# EAGLE design heptaphasis (EAGLE 9.3.2)
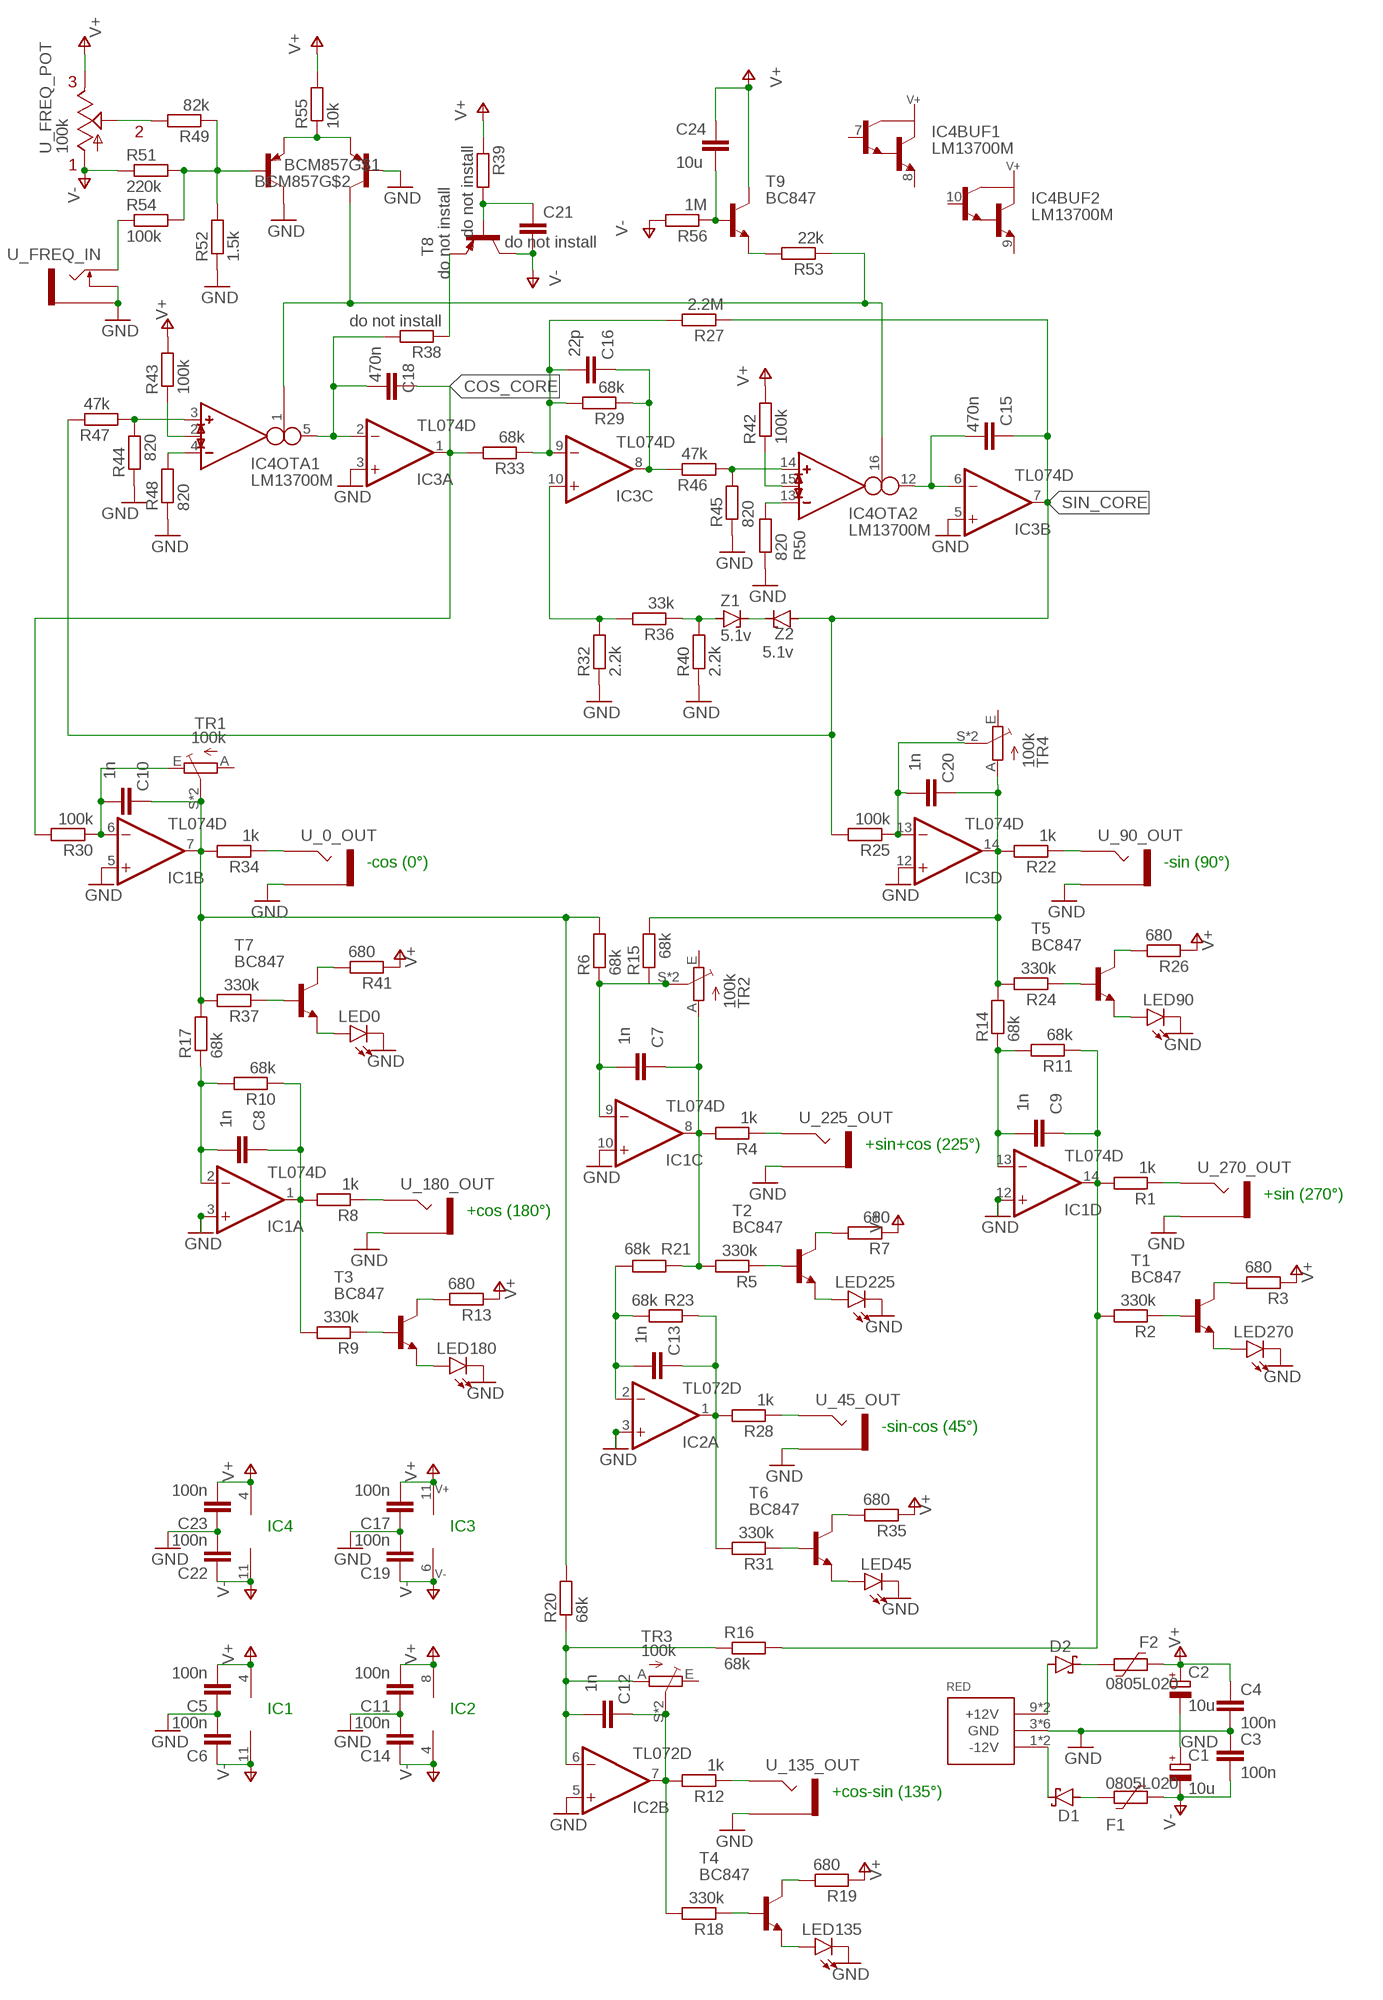
[diagram p0: schematic, sheet 1]

## Parts
BCM857  BCM857DS  [SOT457R_PHILIPS]
C1  10u  CPOL-EUE2-5  [E2-5]
C2  10u  CPOL-EUE2-5  [E2-5]
C3  100n  C-EUC0805  [C0805]
C4  100n  C-EUC0805  [C0805]
C5  100n  C-EUC0805  [C0805]
C6  100n  C-EUC0805  [C0805]
C7  1n  C-EUC0805  [C0805]
C8  1n  C-EUC0805  [C0805]
C9  1n  C-EUC0805  [C0805]
C10  1n  C-EUC0805  [C0805]
C11  100n  C-EUC0805  [C0805]
C12  1n  C-EUC0805  [C0805]
C13  1n  C-EUC0805  [C0805]
C14  100n  C-EUC0805  [C0805]
C15  470n  C-EUC0805  [C0805]
C16  22p  C-EUC0805  [C0805]
C17  100n  C-EUC0805  [C0805]
C18  470n  C-EUC0805  [C0805]
C19  100n  C-EUC0805  [C0805]
C20  1n  C-EUC0805  [C0805]
C21  do not install  C-EUC0805  [C0805]
C22  100n  C-EUC0805  [C0805]
C23  100n  C-EUC0805  [C0805]
C24  10u  C-EUC0805  [C0805]
D1  VERTICAL_SCHOTTKY  [DO41-7]
D2  VERTICAL_SCHOTTKY  [DO41-7]
F1  0805L020  [0805L]
F2  0805L020  [0805L]
IC1  TL074D  [SO14]
IC2  TL072D  [SO08]
IC3  TL074D  [SO14]
IC4  LM13700M  [SO16]
LED0  LED3MM  [LED3MM]
LED45  LED3MM  [LED3MM]
LED90  LED3MM  [LED3MM]
LED135  LED3MM  [LED3MM]
LED180  LED3MM  [LED3MM]
LED225  LED3MM  [LED3MM]
LED270  LED3MM  [LED3MM]
R1  1k  R-EU_R0805  [R0805]
R2  330k  R-EU_R0805  [R0805]
R3  680  R-EU_R0805  [R0805]
R4  1k  R-EU_R0805  [R0805]
R5  330k  R-EU_R0805  [R0805]
R6  68k  R-EU_R0805  [R0805]
R7  680  R-EU_R0805  [R0805]
R8  1k  R-EU_R0805  [R0805]
R9  330k  R-EU_R0805  [R0805]
R10  68k  R-EU_R0805  [R0805]
R11  68k  R-EU_R0805  [R0805]
R12  1k  R-EU_R0805  [R0805]
R13  680  R-EU_R0805  [R0805]
R14  68k  R-EU_R0805  [R0805]
R15  68k  R-EU_R0805  [R0805]
R16  68k  R-EU_R0805  [R0805]
R17  68k  R-EU_R0805  [R0805]
R18  330k  R-EU_R0805  [R0805]
R19  680  R-EU_R0805  [R0805]
R20  68k  R-EU_R0805  [R0805]
R21  68k  R-EU_R0805  [R0805]
R22  1k  R-EU_R0805  [R0805]
R23  68k  R-EU_R0805  [R0805]
R24  330k  R-EU_R0805  [R0805]
R25  100k  R-EU_R0805  [R0805]
R26  680  R-EU_R0805  [R0805]
R27  2.2M  R-EU_R0805  [R0805]
R28  1k  R-EU_R0805  [R0805]
R29  68k  R-EU_R0805  [R0805]
R30  100k  R-EU_R0805  [R0805]
R31  330k  R-EU_R0805  [R0805]
R32  2.2k  R-EU_R0805  [R0805]
R33  68k  R-EU_R0805  [R0805]
R34  1k  R-EU_R0805  [R0805]
R35  680  R-EU_R0805  [R0805]
R36  33k  R-EU_R0805  [R0805]
R37  330k  R-EU_R0805  [R0805]
R38  do not install  R-EU_R0805  [R0805]
R39  do not install  R-EU_R0805  [R0805]
R40  2.2k  R-EU_R0805  [R0805]
R41  680  R-EU_R0805  [R0805]
R42  100k  R-EU_R0805  [R0805]
R43  100k  R-EU_R0805  [R0805]
R44  820  R-EU_R0805  [R0805]
R45  820  R-EU_R0805  [R0805]
R46  47k  R-EU_R0805  [R0805]
R47  47k  R-EU_R0805  [R0805]
R48  820  R-EU_R0805  [R0805]
R49  82k  R-EU_R0805  [R0805]
R50  820  R-EU_R0805  [R0805]
R51  220k  R-EU_R0805  [R0805]
R52  1.5k  R-EU_R0805  [R0805]
R53  22k  R-EU_R0805  [R0805]
R54  100k  R-EU_R0805  [R0805]
R55  10k  R-EU_R0805  [R0805]
R56  1M  R-EU_R0805  [R0805]
RED  POWER_SIMPLE10  [POWER_10]
T1  BC847  [SOT23]
T2  BC847  [SOT23]
T3  BC847  [SOT23]
T4  BC847  [SOT23]
T5  BC847  [SOT23]
T6  BC847  [SOT23]
T7  BC847  [SOT23]
T8  do not install  BC857  [SOT23]
T9  BC847  [SOT23]
TR1  100k  MULTITURN_TRIMPOT_DUAL_FOOTPRINTS64YW  [S64YW]
TR2  100k  MULTITURN_TRIMPOT_DUAL_FOOTPRINTS64YW  [S64YW]
TR3  100k  MULTITURN_TRIMPOT_DUAL_FOOTPRINTS64YW  [S64YW]
TR4  100k  MULTITURN_TRIMPOT_DUAL_FOOTPRINTS64YW  [S64YW]
U_0_OUT  PJ302M_NO_NORM  [PJ302M_NO_NORM]
U_45_OUT  PJ302M_NO_NORM  [PJ302M_NO_NORM]
U_90_OUT  PJ302M_NO_NORM  [PJ302M_NO_NORM]
U_135_OUT  PJ302M_NO_NORM  [PJ302M_NO_NORM]
U_180_OUT  PJ302M_NO_NORM  [PJ302M_NO_NORM]
U_225_OUT  PJ302M_NO_NORM  [PJ302M_NO_NORM]
U_270_OUT  PJ302M_NO_NORM  [PJ302M_NO_NORM]
U_FREQ_IN  PJ302M  [PJ302M]
U_FREQ_POT  100k  RK097-SINGLE  [RK097-SINGLE-ELEMENT]
Z1  5.1v  ZENER-DIODESOD80C  [SOD80C]
Z2  5.1v  ZENER-DIODESOD80C  [SOD80C]

## Nets
0OUT: R34.1 U_0_OUT.TIP
45OUT: R28.1 U_45_OUT.TIP
90OUT: R22.1 U_90_OUT.TIP
135OUT: R12.1 U_135_OUT.TIP
180OUT: R8.1 U_180_OUT.TIP
225OUT: R4.1 U_225_OUT.TIP
270OUT: R1.1 U_270_OUT.TIP
+12DIODE_FUSE: D2.C F2.2
+12SUPPLY: D2.A RED.9(+12V) RED.10(+12V)
-12DIODE_FUSE: D1.A F1.2
-12SUPPLY: D1.C RED.1(-12V) RED.2(-12V)
BUF0_IN: C10.2 IC1.6(B:-IN) R30.1 TR1.E
BUF0OUT: C10.1 IC1.7(B:OUT) R6.2 R17.2 R20.2 R34.2 R37.2 TR1.S TR1.S@1(S)
BUF45_IN: C13.2 IC2.2(A:-IN) R21.1 R23.2
BUF45OUT: C13.1 IC2.1(A:OUT) R23.1 R28.2 R31.2
BUF90_IN: C20.2 IC3.13(D:-IN) R25.1 TR4.S TR4.S@1(S)
BUF90OUT: C20.1 IC3.14(D:OUT) R14.2 R15.2 R22.2 R24.2 TR4.A
BUF135_IN: C12.2 IC2.6(B:-IN) R16.1 R20.1 TR3.A
BUF135OUT: C12.1 IC2.7(B:OUT) R12.2 R18.2 TR3.S TR3.S@1(S)
BUF180_IN: C8.2 IC1.2(A:-IN) R10.2 R17.1
BUF180OUT: C8.1 IC1.1(A:OUT) R8.2 R9.2 R10.1
BUF225_IN: C7.2 IC1.9(C:-IN) R6.1 R15.1 TR2.S TR2.S@1(S)
BUF225OUT: C7.1 IC1.8(C:OUT) R4.2 R5.2 R21.2 TR2.A
BUF270_IN: C9.2 IC1.13(D:-IN) R11.2 R14.1
BUF270OUT: C9.1 IC1.14(D:OUT) R1.2 R2.2 R11.1 R16.2
COS_CORE: C18.1 IC3.1(A:OUT) R30.2 R33.2
COS_INTEG_IN: C18.2 IC3.2(A:-IN) IC4.5(OTA1:OUT) R38.2
COS_OTA1_IN+: IC4.3(OTA1:IN_P) R44.2 R47.1
COS_OTA1_NEGATIVE: IC4.4(OTA1:IN_N) R48.2
EXP_EMITTERS: BCM857.1(E) BCM857.4(E) R55.1
FREQ_CURRENT: BCM857.3(C) IC4.1(OTA1:I_BIAS) IC4.16(OTA2:I_BIAS) R53.1
FREQ_CV_IN: R54.1 U_FREQ_IN.TIP
FREQ_EXP_IN: BCM857.2(B) R49.1 R51.2 R52.2 R54.2
FREQ_POT: R49.2 U_FREQ_POT.P$5(S)
GND: BCM857.5(B) BCM857.6(C) C1.+ C2.- C3.1 C4.2 C5.1 C6.2 C11.1 C14.2 C17.1 C19.2 C22.2 C23.1 IC1.3(A:+IN) IC1.5(B:+IN) IC1.10(C:+IN) IC1.12(D:+IN) IC2.3(A:+IN) IC2.5(B:+IN) IC3.3(A:+IN) IC3.5(B:+IN) IC3.12(D:+IN) LED0.K(C) LED45.K(C) LED90.K(C) LED135.K(C) LED180.K(C) LED225.K(C) LED270.K(C) R32.1 R40.1 R44.1 R45.1 R48.1 R50.1 R52.1 RED.3(GND) RED.4(GND) RED.5(GND) RED.6(GND) RED.7(GND) RED.8(GND) U_0_OUT.GND(SLEEVE) U_45_OUT.GND(SLEEVE) U_90_OUT.GND(SLEEVE) U_135_OUT.GND(SLEEVE) U_180_OUT.GND(SLEEVE) U_225_OUT.GND(SLEEVE) U_270_OUT.GND(SLEEVE) U_FREQ_IN.GND(SLEEVE) U_FREQ_IN.SW(SWITCH)
HP_SUM: C16.1 IC3.8(C:OUT) R29.1 R46.2
LED0+: LED0.A T7.2(E)
LED0PWR: R41.2 T7.3(C)
LED0SIG: R37.1 T7.1(B)
LED45+: LED45.A T6.2(E)
LED45PWR: R35.2 T6.3(C)
LED45SIG: R31.1 T6.1(B)
LED90+: LED90.A T5.2(E)
LED90PWR: R26.2 T5.3(C)
LED90SIG: R24.1 T5.1(B)
LED135+: LED135.A T4.2(E)
LED135PWR: R19.2 T4.3(C)
LED135SIG: R18.1 T4.1(B)
LED180+: LED180.A T3.2(E)
LED180PWR: R13.2 T3.3(C)
LED180SIG: R9.1 T3.1(B)
LED225+: LED225.A T2.2(E)
LED225PWR: R7.2 T2.3(C)
LED225SIG: R5.1 T2.1(B)
LED270+: LED270.A T1.2(E)
LED270PWR: R3.2 T1.3(C)
LED270SIG: R2.1 T1.1(B)
LINEARIZING1: IC4.2(OTA1:I_DIODE) R43.1
LINEARIZING2: IC4.15(OTA2:I_DIODE) R42.1
NEG_FDBK: C16.2 IC3.9(C:-IN) R27.2 R29.2 R33.1
SIN_CORE: C15.1 IC3.7(B:OUT) R25.2 R27.1 R47.2 Z2.A
SIN_FEEDBACK: IC3.10(C:+IN) R32.2 R36.2
SIN_INTEG_IN: C15.2 IC3.6(B:-IN) IC4.12(OTA2:OUT)
SIN_OTA2_IN+: IC4.14(OTA2:IN_P) R45.2 R46.1
SIN_OTA2_NEGATIVE: IC4.13(OTA2:IN_N) R50.2
START_AMP_EMIT: R38.1 T8.2(E)
START_AMP_GATE: C21.1 R39.2 T8.1(B)
START_FREQ_EMIT: R53.2 T9.2(E)
START_FREQ_GATE: C24.2 R56.1 T9.1(B)
V+: C2.+ C4.1 C5.2 C11.2 C17.2 C23.2 C24.1 F2.1 IC1.4(P:V+) IC2.8(P:V+) IC3.4(P:V+) IC4.11(SUPPLY:V+) R3.1 R7.1 R13.1 R19.1 R26.1 R35.1 R39.1 R41.1 R42.2 R43.2 R55.2 T9.3(C) U_FREQ_POT.P$4(E)
V-: C1.- C3.2 C6.1 C14.1 C19.1 C21.2 C22.1 F1.1 IC1.11(P:V-) IC2.4(P:V-) IC3.11(P:V-) IC4.6(SUPPLY:V-) R51.1 R56.2 T8.3(C) U_FREQ_POT.P$6(A)
ZENER_ANODE: R36.1 R40.2 Z1.A
ZENERS_CATHODES: Z1.C Z2.C
Unconnected: IC4.7(BUF1:B) IC4.8(BUF1:E) IC4.9(BUF2:E) IC4.10(BUF2:B) TR1.A TR2.E TR3.E TR4.E

## Notes on the sheet
- -cos (0°) | -sin (90°)
- +sin+cos (225°)
- +sin (270°)
- +cos (180°)
- -sin-cos (45°)
- IC4 | IC3
- IC1 | IC2
- +cos-sin (135°)

## Library data of the parts
BCM857 = svf_quad_lfo:BCM857DS
C1 C2 = rcl:CPOL-EU: POLARIZED CAPACITOR, European symbol; SPICEPREFIX: C
C3-C24 = rcl:C-EU: CAPACITOR, European symbol; SPICEPREFIX: C
D1 D2 = vertical_schottky:VERTICAL_SCHOTTKY
F1 F2 = polyfuse-smd_10:?: Polyfuse Resettable PTC Source: http://www.littelfuse.com/products/resettable-ptcs.aspx; MF: Littelfuse; MPN: 0805L020; OC_FARNELL: 1832107; OC_NEWARK: 05M2226
IC1 IC3 = linear:TL074: OP AMP
IC2 = linear:TL072: OP AMP
IC4 = ota:LM13700: Dual OTA with buffers
LED0 LED45 LED90 LED135 LED180 LED225 LED270 = led:LED: LED OSRAM: - CHIPLED LG R971, LG N971, LY N971, LG Q971, LY Q971, LO R971, LY R971 LH N974, LH R974 LS Q976, LO Q976, LY Q976 LO Q996 - Hyper CHIPLED LW Q18S LB Q993, LB Q99A, LB R99A - SideLED LS A670, LO A670, LY A670, LG A670, LP A670 LB A673, LV A673, LT A673, LW A673 LH A674 LY A675 LS A676, LA A676, LO A676, LY A676, LW A676 LS A679, LY A679, LG A679 - Hyper Micro SIDELED® LS Y876, LA Y876, LO Y876, LY Y876 LT Y87S - SmartLED LW L88C, LW L88S LB L89C, LB L89S, LG L890 LS L89K, LO L89K, LY L89K LS L896, LA L896, LO L896, LY L896 - TOPLED LS T670, LO T670, LY T670, LG T670, LP T670 LSG T670, LSP T670, LSY T670, LOP T670, LYG T670 LG T671, LOG T671, LSG T671 LB T673, LV T673, LT T673, LW T673 LH T674 LS T676, LA T676, LO T676, LY T676, LB T676, LH T676, LSB T676, LW T676 LB T67C, LV T67C, LT T67C, LS T67K, LO T67K, LY T67K, LW E67C LS E67B, LA E67B, LO E67B, LY E67B, LB E67C, LV E67C, LT E67C LW T67C LS T679, LY T679, LG T679 LS T770, LO T770, LY T770, LG T770, LP T770 LB T773, LV T773, LT T773, LW T773 LH T774 LS E675, LA E675, LY E675, LS T675 LS T776, LA T776, LO T776, LY T776, LB T776 LHGB T686 LT T68C, LB T68C - Hyper Mini TOPLED® LB M676 - Mini TOPLED Santana® LG M470 LS M47K, LO M47K, LY M47K Source: http://www.osram.convergy.de LUXEON: - LUMILED® LXK2-PW12-R00, LXK2-PW12-S00, LXK2-PW14-U00, LXK2-PW14-V00 LXK2-PM12-R00, LXK2-PM12-S00, LXK2-PM14-U00 LXK2-PE12-Q00, LXK2-PE12-R00, LXK2-PE12-S00, LXK2-PE14-T00, LXK2-PE14-U00 LXK2-PB12-K00, LXK2-PB12-L00, LXK2-PB12-M00, LXK2-PB14-N00, LXK2-PB14-P00, LXK2-PB14-Q00 LXK2-PR12-L00, LXK2-PR12-M00, LXK2-PR14-Q00, LXK2-PR14-R00 LXK2-PD12-Q00, LXK2-PD12-R00, LXK2-PD12-S00 LXK2-PH12-R00, LXK2-PH12-S00 LXK2-PL12-P00, LXK2-PL12-Q00, LXK2-PL12-R00 Source: www.luxeon.com KINGBRIGHT: KA-3528ASYC Source: www.kingbright.com
R1-R56 = rcl:R-EU_: RESISTOR, European symbol; SPICEPREFIX: R
RED = eurorack:POWER_SIMPLE; SPICEPREFIX: U
T1-T7 T9 = nxp_60_sot457:BC847: 45 V, 100 mA NPN general-purpose transistors NPN general-purpose transistor AAL Eindhoven MK
T8 = nxp_60_sot457:BC857: PNP general purpose transistors AAL Eindhoven MK
TR1-TR4 = trimpot:MULTITURN_TRIMPOT_DUAL_FOOTPRINT: POTENTIOMETER
U_0_OUT U_45_OUT U_90_OUT U_135_OUT U_180_OUT U_225_OUT U_270_OUT = pj302m:PJ302M_NO_NORM: PJ302M horizontal / right angled mount 3.5 mm jack socket
U_FREQ_IN = pj302m:PJ302M: PJ302M horizontal / right angled mount 3.5 mm jack socket
U_FREQ_POT = alps_japan_potentiometers:RK097-SINGLE: SCHEMATIC FOR POTENTIOMETER
Z1 Z2 = diode:ZENER-DIODE: Z-Diode

## Board
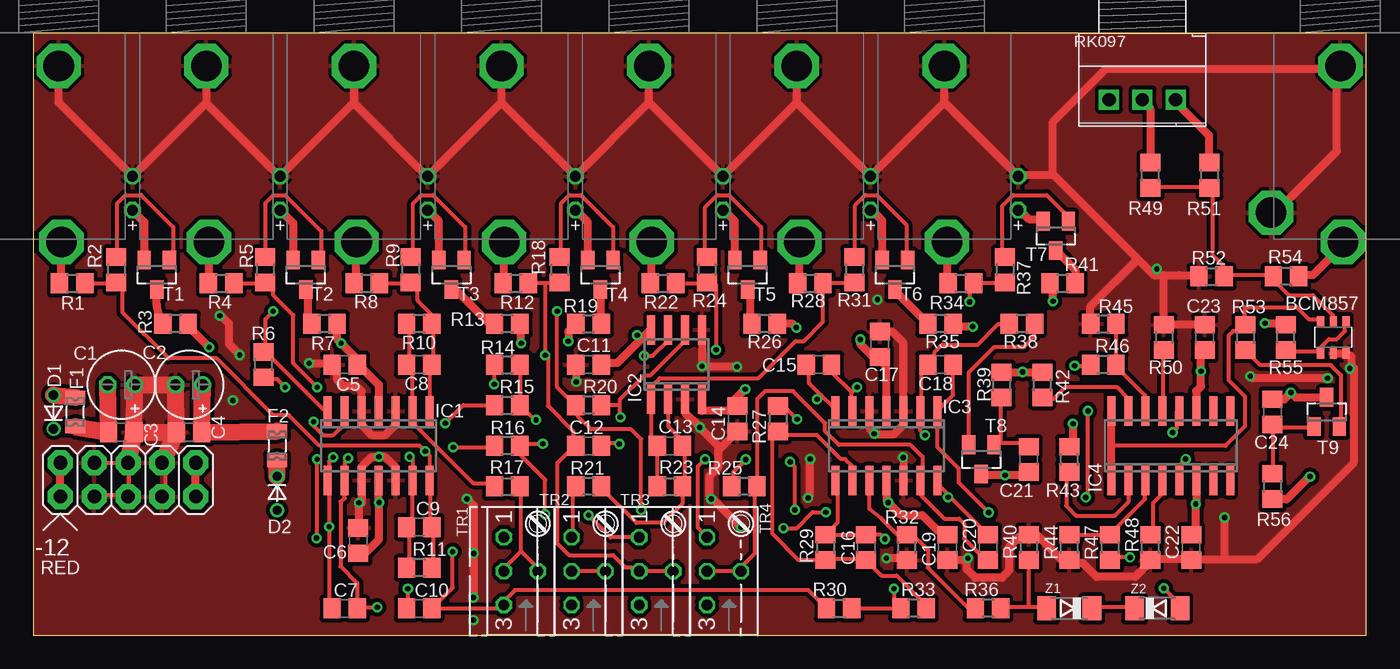
[diagram p1: board, top side]
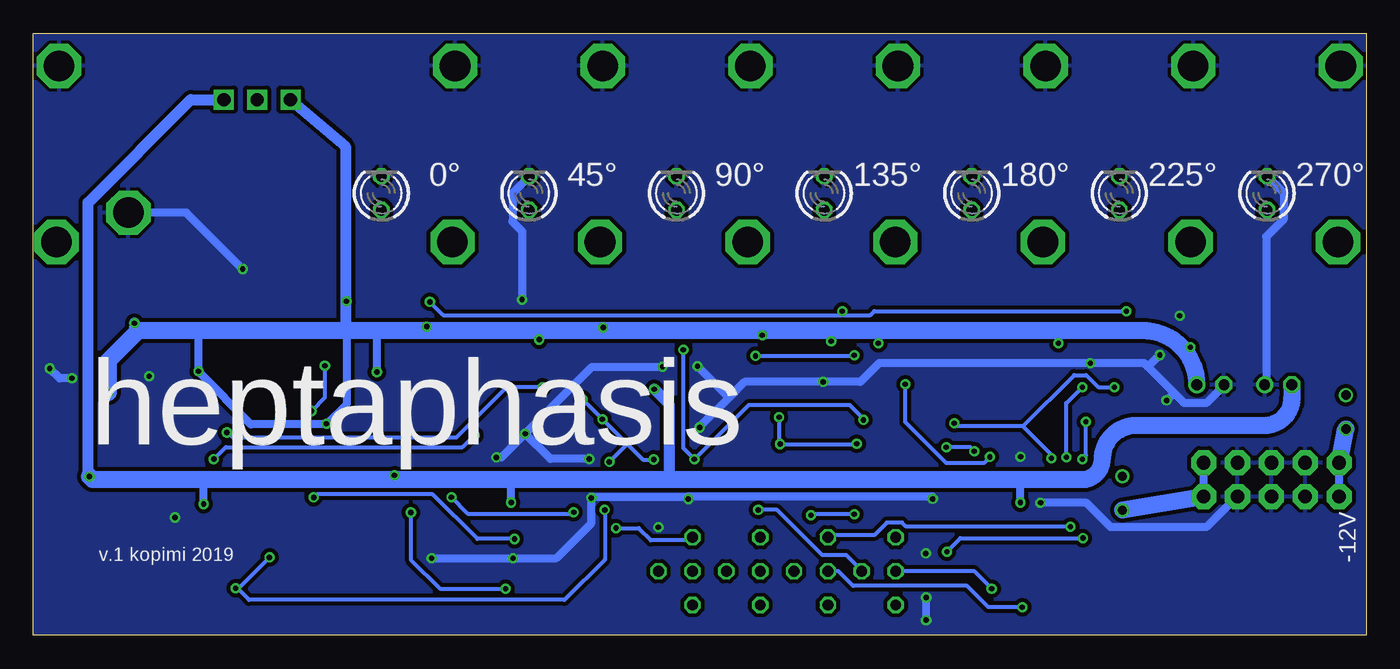
[diagram p2: board, bottom side, seen from below]

Size 100 x 45.16 mm. Coordinates in mm from the lower left corner, seen from the top.
Outline: 0,0 100,0 100,45.16 0,45.16 0,0
Copper layers (1*16): Top 0.035mm / dielectric 1.5mm / Bottom 0.035mm
Design rules "2-vrstvy-trida-6 *": minimum track width 0.3mm, minimum drill 0.3999mm, track to track 0.3mm, track to pad 0.3mm, pad to pad 0.3mm, via to via 0.3mm, smd to smd 0.15mm, copper to edge 0mil, drill to drill 0.5mm, minimum pad ring 0.15mm, minimum via ring 0.18mm, stop-mask expansion 0.05mm, vias tented up to drill 3mm, thermal gap 10mil

### Footprints (pad centres in the part's own frame; a part is rotated, then mirrored left to right if it is on the bottom)
SOT457R_PHILIPS = smd 0.55 x 0.8: 1 -0.95,-1.2; 2 0,-1.2; 3 0.95,-1.2; 4 0.95,1.2; 5 0,1.2; 6 -0.95,1.2
E2-5 = drill 0.813 pad 1.27: + -1.016,0 | drill 0.813 pad 1.27 octagon: - 1.016,0
C0805 = smd 1.3 x 1.5: 1 -0.95,0; 2 0.95,0
DO41-7 = drill 0.7: A 1.27,0; C -1.27,0
0805L = smd 1 x 1.5: 1 -1.1,0; 2 1.1,0
SO14 = smd 0.6 x 2.2: 1 -3.81,-2.6; 2 -2.54,-2.6; 3 -1.27,-2.6; 4 0,-2.6; 5 1.27,-2.6; 6 2.54,-2.6; 7 3.81,-2.6; 8 3.81,2.6; 9 2.54,2.6; 10 1.27,2.6; 11 0,2.6; 12 -1.27,2.6; 13 -2.54,2.6; 14 -3.81,2.6
SO08 = smd 0.6 x 2.2: 1 -1.905,-2.6; 2 -0.635,-2.6; 3 0.635,-2.6; 4 1.905,-2.6; 5 1.905,2.6; 6 0.635,2.6; 7 -0.635,2.6; 8 -1.905,2.6
SO16 = smd 0.6 x 2.2: 1 -4.445,-2.6; 2 -3.175,-2.6; 3 -1.905,-2.6; 4 -0.635,-2.6; 5 0.635,-2.6; 6 1.905,-2.6; 7 3.175,-2.6; 8 4.445,-2.6; 9 4.445,2.6; 10 3.175,2.6; 11 1.905,2.6; 12 0.635,2.6; 13 -0.635,2.6; 14 -1.905,2.6; 15 -3.175,2.6; 16 -4.445,2.6
LED3MM = drill 0.813 octagon: A -1.27,0; K 1.27,0
R0805 = smd 1.3 x 1.5: 1 -0.95,0; 2 0.95,0
POWER_10 = drill 1.016 pad 1.88 octagon: 1 -5.08,-1.27; 2 -5.08,1.27; 3 -2.54,-1.27; 4 -2.54,1.27; 5 0,-1.27; 6 0,1.27; 7 2.54,-1.27; 8 2.54,1.27; 9 5.08,-1.27; 10 5.08,1.27
SOT23 = smd 1 x 1.4: 1 -0.95,-1.1; 2 0.95,-1.1; 3 0,1.1
S64YW = drill 0.813 octagon: A 2.54,1.27; E -2.54,1.27; S 0,-1.27; S@1 0,1.27
PJ302M_NO_NORM = drill 2.3 pad 3.3 octagon: GND 2.5,0; TIP 15.7,0.2
PJ302M = drill 2.3 pad 3.3 octagon: GND 2.5,0; SW 13.5,-5.2; TIP 15.7,0.2
RK097-SINGLE-ELEMENT = drill 1 pad 1.422 square: P$4 2.5,0; P$5 0,0; P$6 -2.5,0
SOD80C = smd 1.4 x 1.8: A 1.7,0; C -1.7,0

### Placement (x,y rotation side)
BCM857  97.54,22.35 180 top
C1  6.6,18.8 180 top
C2  11.68,18.8 180 top
C3  6.6,15.24 180 top
C4  11.68,15.24 180 top
C5  23.37,20.32 0 top
C6  24.38,7.11 90 top
C7  23.37,2.03 0 top
C8  28.96,20.32 180 top
C9  28.96,8.13 180 top
C10  28.96,2.03 0 top
C11  41.66,20.32 0 top
C12  41.66,14.22 0 top
C13  47.75,14.22 0 top
C14  52.83,16.26 270 top
C15  58.93,20.32 0 top
C16  62.48,6.6 270 top
C17  63.5,21.84 270 top
C18  68.07,20.32 180 top
C19  68.58,6.6 270 top
C20  71.63,6.6 270 top
C21  74.68,13.21 270 top
C22  86.87,6.6 270 top
C23  87.88,22.35 270 top
C24  92.96,16.76 270 top
D1  1.52,16.76 90 top
D2  18.29,10.67 270 top
F1  3.15,16.76 90 top
F2  18.29,14.22 270 top
IC1  25.91,14.22 180 top
IC2  48.26,20.32 0 top
IC3  64.01,14.22 180 top
IC4  85.34,14.22 0 top
LED0  73.89,33.17 90 bottom
LED45  62.81,33.17 90 bottom
LED90  51.74,33.17 90 bottom
LED135  40.67,33.17 90 bottom
LED180  29.59,33.17 90 bottom
LED225  18.52,33.17 90 bottom
LED270  7.44,33.17 90 bottom
R1  2.92,26.42 0 top
R2  6.22,27.43 270 top
R3  10.67,23.37 180 top
R4  14.1,26.42 0 top
R5  17.4,27.43 270 top
R6  17.27,20.32 90 top
R7  21.84,23.37 180 top
R8  25.02,26.42 0 top
R9  28.32,27.43 270 top
R10  28.96,23.37 180 top
R11  28.96,5.08 180 top
R12  36.2,26.42 0 top
R13  35.56,23.37 180 top
R14  35.56,20.32 0 top
R15  35.56,17.27 0 top
R16  35.56,14.22 180 top
R17  35.56,11.18 0 top
R18  39.5,27.43 270 top
R19  41.66,23.37 0 top
R20  41.66,17.27 180 top
R21  41.66,11.18 180 top
R22  47.24,26.42 0 top
R23  47.75,11.18 0 top
R24  50.55,27.43 270 top
R25  53.34,11.18 180 top
R26  54.86,23.37 180 top
R27  55.88,16.26 270 top
R28  58.29,26.42 0 top
R29  59.44,6.6 270 top
R30  60.45,2.03 0 top
R31  61.59,27.43 270 top
R32  65.53,6.6 90 top
R33  66.04,2.03 180 top
R34  69.6,26.42 0 top
R35  68.07,23.37 180 top
R36  71.63,2.03 180 top
R37  72.9,27.43 270 top
R38  74.17,23.37 180 top
R39  72.64,18.8 270 top
R40  74.68,6.6 270 top
R41  77.22,26.42 0 top
R42  75.69,18.8 90 top
R43  77.72,13.21 90 top
R44  77.72,6.6 90 top
R45  80.26,23.37 0 top
R46  80.26,20.32 180 top
R47  80.77,6.6 270 top
R48  83.82,6.6 90 top
R49  83.82,34.52 90 top
R50  84.84,22.35 270 top
R51  88.24,34.52 270 top
R52  88.39,26.92 0 top
R53  90.93,22.35 270 top
R54  93.98,26.92 180 top
R55  93.98,22.35 90 top
R56  92.96,11.18 270 top
RED  7.11,11.68 0 top
T1  9.27,27.05 180 top
T2  20.45,27.05 180 top
T3  31.37,27.05 180 top
T4  42.55,27.05 180 top
T5  53.59,27.05 180 top
T6  64.64,27.05 180 top
T7  76.71,29.97 180 top
T8  71.12,13.21 180 top
T9  97.03,16.76 0 top
TR1  36.58,4.83 90 top
TR2  41.66,4.83 90 top
TR3  46.74,4.83 90 top
TR4  51.82,4.83 90 top
U_0_OUT  68.35,45.21 270 top
U_45_OUT  57.28,45.21 270 top
U_90_OUT  46.2,45.21 270 top
U_135_OUT  35.13,45.21 270 top
U_180_OUT  24.05,45.21 270 top
U_225_OUT  12.98,45.21 270 top
U_270_OUT  1.91,45.21 270 top
U_FREQ_IN  98.07,45.21 270 top
U_FREQ_POT  83.21,40.18 180 top
Z1  77.72,2.03 180 top
Z2  84.33,2.03 0 top

### Tracks (layer width: path | path; a pad name or v marks a point on that pad's centre or on a via)
0OUT
  Top 0.3: U_0_OUT.TIP 68.56,29.5 | 68.56,26.42 R34.1
  Top 0.61: 68.56,29.5 68.56,26.42
45OUT
  Top 0.3: 57.46,26.43 R28.1 | 57.46,29.5 U_45_OUT.TIP
  Top 0.61: 57.46,29.5 57.46,26.43
90OUT
  Top 0.3: 46.36,26.42 R22.1 | 46.36,29.49 U_90_OUT.TIP
  Top 0.61: 46.36,29.49 46.36,26.42
135OUT
  Top 0.3: 35.28,26.42 R12.1 | 35.28,29.49 U_135_OUT.TIP
  Top 0.61: 35.28,29.49 35.28,26.42
180OUT
  Top 0.3: 24.18,26.42 R8.1 | 24.18,29.48 U_180_OUT.TIP
  Top 0.61: 24.18,29.48 24.18,26.42
225OUT
  Top 0.3: R4.1 | 13.15,29.5 U_225_OUT.TIP
  Top 0.61: 13.15,29.5 R4.1
270OUT
  Top 0.3: 2.05,29.07 2.09,29.11 U_270_OUT.TIP | 2.05,26.42 R1.1
  Top 0.61: 2.05,29.07 2.05,26.42
+12DIODE_FUSE
  Top 1.27: D2.C F2.2
+12SUPPLY
  Top 0.61: RED.9 RED.10
  Bottom 0.61: RED.9 RED.10
  Bottom 1.27: RED.9 D2.A
-12DIODE_FUSE
  Top 1.27: D1.A F1.2
-12SUPPLY
  Top 0.61: RED.1 RED.2
  Bottom 0.61: RED.1 RED.2
  Bottom 1.27: RED.2 D1.C
BUF0_IN  (via drill 0.4)
  Top 0.3: C10.2 29.92,2.02 34.97,2.02 TR1.E 35.31,2.56 36.13,3.4 58.14,3.4 R30.1 | v21.02,16.03 21.02,15.72 21.73,15.02 22.5,15.02 23.34,15.86 23.34,16.82 IC1.6
  Top 0.305: C10.2 31.46,3.59 v31.46,6.29 | v21.3,13.22 21.25,13.17 v21.25,7.3
  Bottom 0.3: v21.02,16.03 21.02,13.49 v21.3,13.22
  Bottom 0.305: v31.46,6.29 30.44,7.3 v21.25,7.3
BUF0OUT  (via drill 0.4)
  Top 0.3: v28.1,3.5 28.1,2.12 C10.1 | 36.6,6.32 36.6,11.12 R17.2 | 36.6,6.32 35.4,5.12 TR1.S@1 | IC1.7 21.9,16.82 17.7,21.02 17.4,21.02 R6.2 17.4,21.32 17.4,23.72 v18,24.32 | R37.2 72.85,26.42 70.62,26.42 R34.2 70.25,26.04 v70.25,25.02 | v45.62,9.42 45.6,9.43 45.6,14.72 44.86,15.46 41.83,15.46 40.88,16.41 40.88,17.04 40.8,17.12 R20.2 40.5,17.42 39.3,18.62 v39.3,24.32 | 36.6,6.32 37.8,5.12 TR1.S
  Bottom 0.3: v28.1,3.5 29.44,4.85 35.28,4.85 TR1.S@1 | v45.62,9.42 44.2,9.42 40.8,6.02 39,6.02 38.1,5.12 TR1.S | v70.25,25.02 69.25,24.02 39.6,24.02 | v39.3,24.32 39.6,24.02 | v18,24.32 36.9,24.32 37.2,24.02 39.6,24.02
BUF45_IN
  Top 0.3: R21.1 42.61,11.07 45.24,8.44 47.26,8.44 48.7,9.88 R23.2 48.9,11.42 48.9,14.12 C13.2 48.9,14.42 47.66,15.66 47.66,17.72 IC2.2
BUF45OUT
  Top 0.3: R31.2 61.33,26.42 59.1,26.42 59.11,26.41 R28.2 59.24,23.52 57.81,22.08 57.2,22.08 54.42,19.3 47.01,19.3 46.5,18.79 46.5,17.72 IC2.1 46.34,17.7 46.34,14.88 46.8,14.42 C13.1 46.8,14.12 46.8,11.42 R23.1
BUF90_IN
  Top 0.3: TR4.S@1 50.7,4.82 52.8,4.82 TR4.S 53.1,5.12 54.14,6.16 54.14,11.15 R25.1 54.3,11.42 54.3,17.72 54.9,18.32 57,18.32 59.4,15.92 59.4,15.32 60.42,14.29 65.82,14.29 66.71,13.4 66.71,11.69 66.64,11.62 IC3.13 66.6,11.42 66.6,10.52 68.35,8.77 69.45,8.77 69.85,8.37 69.85,7.27 71.4,5.72 C20.2
BUF90OUT  (via drill 0.4)
  Top 0.3: R24.2 51.23,26.27 v51.23,21.43 | 68.63,10.59 67.8,11.42 IC3.14 | v50.4,13.22 49.85,12.67 49.85,8.1 TR4.A
  Top 0.305: 68.63,10.59 v68.63,10.37 68.82,10.37 C20.1 | v56.28,8.05 57.28,8.05 58.47,9.25 v59.46,9.25 | R14.2 R15.2 37.61,16.17 v37.72,16.17 | R22.2 50.48,26.42 R24.2
  Bottom 0.3: v51.23,21.43 51.23,14.05 v50.4,13.22
  Bottom 0.305: v56.28,8.05 54.59,8.05 53.67,7.14 50.77,7.14 TR4.A | v59.46,9.25 59.57,9.14 67.4,9.14 v68.63,10.37 | v50.4,13.22 46.32,17.3 38.76,17.3 37.72,16.25 v37.72,16.17
BUF135_IN  (via drill 0.4)
  Top 0.3: v43.97,14.36 43.91,14.42 42.9,14.42 C12.2 | v44.05,16.36 44,16.36 44,17.23 44,17.67 45.85,19.52 46.32,19.52 48.93,22.12 48.93,22.89 IC2.6 | 38.06,12.01 36.6,13.47 36.6,14.12 R16.1 36.58,14.38 v38.23,14.38
  Top 0.305: TR3.A 43.31,7.37 v41.66,9.02 | 38.06,12.01 38.41,11.67 v38.41,9.09 | 44,17.23 43.96,17.27 R20.1
  Bottom 0.3: v44.05,16.36 44.05,14.44 v43.97,14.36 38.25,14.36 v38.23,14.38
  Bottom 0.305: v38.41,9.09 41.58,9.09 v41.66,9.02
BUF135OUT  (via drill 0.4)
  Top 0.3: TR3.S 45.6,4.82 TR3.S@1 45.3,5.12 44.4,5.12 43.5,6.02 40.2,6.02 39.3,6.92 39.3,12.92 40.5,14.12 C12.1 40.5,14.42 40.5,15.32 38.6,17.22 38.6,20.82 v38.4,21.02 38.4,26.42 | 38.4,26.42 39.47,26.42 R18.2 | 38.4,26.42 37.23,26.42 R12.2 | IC2.7 47.66,22.88 47.66,22.16 46.48,20.97 v45.81,20.97
  Bottom 0.3: v45.81,20.97 38.45,20.97 v38.4,21.02
BUF180_IN
  Top 0.3: R10.2 28.2,23.12 28.2,20.42 C8.2 28.44,19.87 28.44,16.84 IC1.2 28.5,16.82 28.5,15.92 33,11.42 34.5,11.42 R17.1
BUF180OUT
  Top 0.3: IC1.1 29.73,16.83 29.73,20.14 C8.1 30,20.42 30,23.12 R10.1 30.34,23.61 28.84,25.11 28.84,25.96 R9.2
  Top 0.305: R8.2 28.25,26.42 R9.2
BUF225_IN  (via drill 0.4)
  Top 0.3: TR2.S@1 40.5,4.82 42.9,4.82 TR2.S | v23.61,13.29 23.4,13.08 23.4,11.72 IC1.9 23.37,10.29 23.04,10.04 23.04,5.18 24.3,3.92 24.3,2.12 C7.2 24.6,2.12 v25.8,2.12 | v18.9,18.62 18.3,19.22 17.4,19.22 R6.1
  Top 0.305: v30.9,15.92 32.25,17.27 R15.1
  Bottom 0.3: v30.9,15.92 30.7,15.72 25.79,15.72 25.74,15.68 | 25.74,15.68 23.61,13.54 v23.61,13.29 | v18.9,18.62 20.1,18.62 21,19.52 21.9,19.52 25.74,15.68 | v25.8,2.12 28.35,2.12 29.95,3.72 38.5,3.72 39.6,4.82 40.2,4.82 TR2.S@1
BUF225OUT  (via drill 0.4)
  Top 0.3: R21.2 40.5,11.12 40.5,7.52 TR2.A | 17.32,26.42 R5.2 18,26.31 18,25.52 19.5,24.02 19.5,20.42 v21.3,18.62 | C7.1 22.2,2.12 v22.2,8.16 22.2,11.42 IC1.8 22.19,11.71 22.19,13.06 v22.5,13.37
  Top 0.305: R4.2 17.32,26.42
  Bottom 0.3: v21.3,18.62 v21.31,18.62 22.5,17.43 v22.5,13.37 | 35.99,8.43 36.9,7.52 40.2,7.52 TR2.A
  Bottom 0.305: v22.2,8.16 34.53,8.16 34.82,8.46 35.96,8.46 35.99,8.43
BUF270_IN  (via drill 0.4)
  Top 0.3: R11.2 28.2,5.12 28.2,8.12 C9.2 28.43,8.76 28.43,11.61 IC1.13 28.44,13.2 28.25,13.39 v28.23,13.39 | v34.58,18.84 34.59,18.85 34.59,20.3 R14.1
  Bottom 0.3: v34.58,18.84 34.58,16 31.5,12.92 28.7,12.92 v28.23,13.39
BUF270OUT  (via drill 0.4)
  Top 0.3: 6.22,26.42 R2.2 6.7,26.38 6.7,24.22 10.14,20.78 13.74,20.78 18,16.52 19.18,16.52 21.45,14.24 28.98,14.24 v29.4,13.82 29.72,13.5 IC1.14 29.76,11.6 29.76,8.28 C9.1 30,8.12 30,5.12 R11.1 | v31.5,14.12 34.5,14.12 R16.2
  Top 0.305: R1.2 6.21,26.42 6.22,26.42
  Bottom 0.3: v31.5,14.12 29.7,14.12 v29.4,13.82
COS_CORE  (via drill 0.4)
  Top 0.3: C18.1 69,20.12 69,18.02 68.1,17.12 IC3.1 67.83,14.12 69.44,12.51
  Top 0.305: R30.2 R33.2 64.57,2.56 v64.57,3.5 | v71.68,9.22 69.44,11.46 69.44,12.51
  Bottom 0.305: v71.68,9.22 71.68,5.69 69.49,3.5 v64.57,3.5
COS_INTEG_IN  (via drill 0.4)
  Top 0.3: C18.2 66.9,20.12 66.6,19.82 66.6,17.12 IC3.2 66.52,16.8 66.52,15.4 v66.9,15.02 | 86.1,11.72 IC4.5
  Top 0.305: v86.46,13.23 86.1,12.87 86.1,11.72 | C18.2 67.61,20.81 67.61,21.26 68.17,21.82 70.87,21.82 72.42,23.37 R38.2
  Bottom 0.3: v86.46,13.23 85.56,14.12 67.8,14.12 v66.9,15.02
COS_OTA1_IN+
  Top 0.3: R44.2 78,7.52 80.7,7.52 R47.1 81,7.82 83.4,10.22 83.4,11.42 IC4.3
COS_OTA1_NEGATIVE
  Top 0.3: R48.2 84,7.82 84,9.92 84.6,10.52 84.6,11.42 IC4.4
EXP_EMITTERS
  Top 0.3: 96.3,21.32 94.2,21.32 R55.1 | 96.3,21.32 96.6,21.32 BCM857.4 | 96.3,21.32 97.2,22.22 97.8,22.22 98.4,22.82 98.4,23.42 BCM857.1
FREQ_CURRENT
  Top 0.3: 90.88,24.62 94.8,24.62 95.7,23.72 96.6,23.72 BCM857.3
  Top 0.305: 90.88,24.62 90.88,23.35 R53.1 90.47,22.84 90.02,22.84 89.66,22.48 89.66,19.18 90.91,17.93 90.91,15.7 89.43,14.22 80.9,14.22
  Top 0.61: IC4.1 80.9,14.22 IC4.16
FREQ_CV_IN
  Top 0.3: 95.1,27.02 R54.1 | 97.83,28.85 U_FREQ_IN.TIP
  Top 0.61: 95.1,27.02 96,27.02 97.83,28.85
FREQ_EXP_IN
  Top 0.3: R49.1 84,33.62 88.2,33.62 R51.2 88.5,33.32 88.5,28.52 90,27.02 | BCM857.2 97.5,23.72 97.5,24.02 96,25.52 94.2,25.52 93,26.72 R54.2 93,27.02 90,27.02 | 90,27.02 89.4,27.02 R52.2
FREQ_POT
  Top 0.3: 83.21,40.11 U_FREQ_POT.P$5
  Top 0.61: 83.21,40.11 83.8,39.52 83.8,35.51 R49.2
GND  (via drill 0.4)
  Top 0.3: 97.8,41.42 97.8,42.6 U_FREQ_IN.GND 98.01,42.49 97.73,41.42 | 93.84,32.37 U_FREQ_IN.SW | 87.3,27.02 R52.1 | IC3.3 65.24,16.82 65.24,15.76 | 62.74,16.79 62.74,16.8 IC3.5 | 57.3,42.6 U_45_OUT.GND | 78,5.42 R44.1 | 83.7,5.42 R48.1 84,5.72 | 87,5.72 C22.2 86.7,5.72 | 74.05,7.48 R40.1 | IC1.3 27.18,15.8 | 24.66,15.76 24.66,16.82 IC1.5 | 24.65,12.67 IC1.10 | RED.4 4.8,12.92 6.6,12.92 RED.6 7.2,12.62 7.2,10.52 RED.5 6.9,10.52 4.8,10.52 RED.3 | RED.7 9.9,10.52 9.9,12.62 RED.8 | 22.2,20.42 C5.1
  Top 0.305: IC3.12 arc90 IC3.12 | v50.85,10.24 50.92,10.24 50.95,10.27
  Top 0.61: 93.84,32.37 97.8,36.32 97.8,41.42 97.73,41.42 | 84.08,27.02 84.78,27.02 | 84.78,27.02 86.02,27.02 87.3,27.02 | 76.5,34.6 82.87,28.23 | 82.87,28.23 84.08,27.02 | 62.74,16.79 62.74,15.55 63.16,15.13 v63.09,15.13 63.09,15.1 64.58,15.1 65.24,15.76 | 98.01,42.49 80.46,42.49 76.5,38.53 76.5,34.6 | 76.5,34.6 76.5,34.52 73.97,34.52 LED0.K 68.35,39.98 | 78,5.42 78.75,5.42 79.78,4.39 82.67,4.39 83.7,5.42 | BCM857.5 98.48,21.14 BCM857.6 98.9,20.89 98.9,20.05 | 87,5.72 89.38,5.72 | 89.38,5.72 91.82,5.72 99.1,13 99.1,20.05 98.9,20.05 | 86.7,5.72 84,5.72 | R32.1 65.39,5.79 v64.01,5.79 | 74.05,7.48 73.18,6.6 73.18,4.83 72.67,4.32 70.66,4.32 70.05,4.93 70.05,5.65 | 51.4,13.88 51.4,12.62 50.72,11.95 50.72,10.5 50.95,10.27 v53.1,8.12 | 27.18,15.8 26.4,15.02 25.4,15.02 24.66,15.76 | IC1.10 | IC1.10 24.64,9.95 v24.43,9.95 24.43,8.11 C6.2 | IC1.12 27.18,12.61 26.38,13.4 v25.93,13.4 25.39,13.4 24.65,12.67 | v20.7,20.42 22.2,20.42 | U_225_OUT.GND 12.98,39.92 | v65.25,13.36 65.28,13.33 IC3.12 | v58.28,13.24 58.23,13.19 58.23,10.42 v58.13,10.32 | 89.38,5.72 v89.38,8.85 | v98.77,20.02 98.7,20.02 98.7,20.05 98.9,20.05 | v97.1,19.29 91.46,19.29 v91.31,19.44 | v32.53,10.24 33.04,9.74 v33.04,6.15 33.04,2.88 v33.01,2.85 | C5.1 22.76,19.98 22.76,19.23 23.24,18.75 24.21,18.75 24.64,18.32 IC1.5 | v15.49,21.04 14.68,21.84 14.68,23.39 14.09,23.98 v13.99,23.98 | 51.4,13.88 C14.2 | 51.4,13.88 51.4,14.2 v50.01,15.6 48.9,16.71 IC2.3 | v70.12,5.79 70.02,5.69 70.05,5.65 | 70.05,5.65 C19.2 | R44.1 77.17,5.65 75.28,7.55 R40.1 | v40.74,19.02 40.74,20.29 C11.1 | 46.2,39.98 LED135.K 35.1,40.01 | 46.2,39.98 U_90_OUT.GND | 46.2,39.98 LED90.K 57.3,40
  Top 0.61: 35.1,40.01 35.1,41.8 35.13,41.83 U_135_OUT.GND | 12.98,39.92 18.46,34.44 LED225.K 23.92,39.85 24.05,39.85 U_180_OUT.GND 24.05,39.9 29.51,34.44 LED180.K 35.1,39.95 35.1,40.01 | U_270_OUT.GND 1.91,39.98 LED270.K 12.92,39.92 12.98,39.92 | 57.3,40 57.3,42.6 | 57.3,40 57.3,39.96 LED45.K 68.35,39.98 | 68.35,39.98 U_0_OUT.GND | IC2.5 v50.16,20.19 50.2,20.16 v52.79,20.16 | C17.1 64.44,22.78 65.28,21.95 IC3.3 | R45.1 79.31,24.68 82.87,28.23 | C23.1 R50.1 84.84,26.97 84.78,27.02 | v84.29,27.48 84.08,27.27 84.08,27.02
  Top 1.27: RED.6 C3.1 | RED.8 C4.2 | C4.2 C2.- C1.+ C3.1 | C3.1 C4.2
  Bottom 0.3: 9.9,10.22 RED.7 | 10.8,18.62 C2.- | 7.5,18.92 C1.+ | 7.2,34.22 LED270.K
  Bottom 0.305: v50.85,10.24 v50.86,10.25 50.86,10.42 | v32.54,10.25 32.54,10.42
  Bottom 0.61: v63.33,25.19 63.33,30.32 64.05,31.04 64.05,33.17 63,34.22 LED45.K | v70.12,5.79 v64.01,5.79 60.76,5.79 58.13,8.43 v58.13,10.32 58.03,10.42 50.86,10.42 32.54,10.42 | v24.43,9.95 20.99,9.95 19.16,8.12 12,8.12 9.9,10.22 | 14.47,18.22 13.66,17.42 12,17.42 10.8,18.62 | 14.47,18.22 16.43,20.19 | 16.43,20.19 16.66,20.42 v20.7,20.42 36.55,20.42 37.95,19.02 v40.74,19.02 v40.74,19.03 40.74,19.05 40.77,19.02 46.63,19.02 47.82,17.84 | 7.5,18.92 7.5,29.91 6.2,31.21 6.2,33.22 7.2,34.22 | v63.09,15.13 64.87,13.36 v65.25,13.36 | v58.28,13.24 61.2,13.24 v63.09,15.13 | v84.29,27.48 88.52,31.71 U_FREQ_IN.SW | v32.53,10.24 v32.54,10.25 | v97.1,19.29 98.04,19.29 v98.77,20.02 | v33.01,1.15 v33.01,2.85 | v14.98,17.64 14.47,18.15 14.47,18.22 | v15.49,21.04 16.33,20.19 16.43,20.19 | v50.01,15.6 50.01,15.65 47.82,17.84 | v63.09,15.13 58.09,20.14 52.81,20.14 v52.79,20.16 | v50.16,20.19 47.82,17.84
  pour Bottom: 0.15,0.15 0.15,45.01 99.85,45.01 99.85,0.15
  pour Top: 0.15,0.15 0.15,45.01 99.85,45.01 99.85,0.15
HP_SUM  (via drill 0.4)
  Top 0.3: 79.3,20.28 R46.2
  Top 0.305: v79.13,16.83 79.09,16.79 79.09,10.49 v78.96,10.36 | IC3.8 60.34,11.48 60.34,8.46 R29.1 C16.1 63.58,7.55 v63.9,7.24 | v78.13,20.23 79.25,20.23 79.3,20.28
  Bottom 0.305: v78.13,20.23 78.13,17.84 v79.13,16.83 | v78.96,10.36 78.73,10.59 70.03,10.59 66.68,7.24 v63.9,7.24
LED0+
  Top 0.3: 75.6,31.22 T7.2 | 74.1,31.82 LED0.A
  Top 0.61: 75.6,31.22 74.7,31.22 74.1,31.82
LED0PWR
  Top 0.3: T7.3 76.72,28.89
  Top 0.61: 76.72,28.89 78.17,27.44 R41.2
LED0SIG
  Top 0.3: T7.1 77.76,31.17 77.76,31.29 76.03,33.02 73.5,33.02 72.7,32.22 72.7,29 R37.1
LED45+
  Top 0.3: 63.68,28.16 T6.2 | 63,31.82 LED45.A
  Top 0.61: 63.68,28.16 63.68,31.14 63,31.82
LED45PWR
  Top 0.61: R35.2 64.64,25.85 T6.3
LED45SIG
  Top 0.3: T6.1 65.63,28.25 65.5,28.8 65.5,30.82 63.3,33.02 62.4,33.02 61.65,32.27 61.65,28.63 R31.1
LED90+
  Top 0.3: 51.9,31.82 LED90.A
  Top 0.61: T5.2 52.62,28.17 52.62,31.1 51.9,31.82
LED90PWR
  Top 0.3: 53.77,25.7 T5.3
  Top 0.305: R26.2 53.77,23.51
  Top 0.61: 53.77,25.7 53.77,23.51
LED90SIG
  Top 0.3: T5.1 54.6,28.23 54.6,30.62 52.2,33.02 51.3,33.02 50.4,32.12 50.4,28.82 50.55,28.62 R24.1
LED135+
  Top 0.3: 40.8,31.82 LED135.A
  Top 0.61: 40.8,31.82 41.6,31.02 41.6,28.2 T4.2
LED135PWR
  Top 0.3: 42.6,25.79 T4.3 | 42.6,23.42 R19.2
  Top 0.61: 42.6,23.42 42.6,25.79
LED135SIG
  Top 0.3: T4.1 43.5,28.16 43.5,30.62 41.1,33.02 40.2,33.02 39.6,32.42 39.6,28.97 R18.1
LED180+
  Top 0.3: 30.4,28.17 T3.2 | 29.7,31.82 LED180.A
  Top 0.61: 30.4,28.17 30.4,31.12 29.7,31.82
LED180PWR
  Top 0.3: 31.68,25.95 T3.3 | 34.5,23.12 R13.2
  Top 0.61: 34.5,23.12 31.68,25.95
LED180SIG
  Top 0.3: T3.1 32.4,28.66 32.4,30.62 30,33.02 29.1,33.02 28.5,32.42 28.5,28.86 R9.1
LED225+
  Top 0.3: 18.6,31.82 LED225.A
  Top 0.61: T2.2 19.5,30.93 18.6,31.82
LED225PWR
  Top 0.3: R7.2 20.59,23.67 | 20.59,25.77 T2.3
  Top 0.61: 20.59,25.77 20.59,23.67
LED225SIG
  Top 0.3: T2.1 21.6,28.48 21.6,30.32 18.9,33.02 18,33.02 17.4,32.42 R5.1
LED270+
  Top 0.3: 7.5,31.82 LED270.A
  Top 0.61: T1.2 8.32,31 7.5,31.82
LED270PWR
  Top 0.3: 9.6,23.42 R3.2
  Top 0.61: 9.6,23.42 9.6,23.43 9.27,24.77 T1.3
LED270SIG
  Top 0.3: T1.1 10.5,28.94 10.5,30.62 8.1,33.02 6.9,33.02 6.3,32.42 6.3,28.82 6.22,28.82 R2.1
LINEARIZING1
  Top 0.3: IC4.2 82.15,11.6 82.15,10.01 81.14,9
  Top 0.305: 81.14,9 78.23,9 77.5,9.73 77.5,12.03 R43.1
LINEARIZING2
  Top 0.3: R42.1 75.9,17.72 76.54,17.72 77.43,18.6 81.32,18.6 82.16,17.76 82.16,16.84 IC4.15
NEG_FDBK
  Top 0.3: R29.2 59.7,5.72 62.4,5.72 C16.2 62.7,5.42 63.63,4.49 | IC3.9 61.52,11.67 61.52,12.61 60.9,13.22 60.6,13.22 58.8,15.02 56.1,15.02 R27.2
  Top 0.305: R29.2 57.42,5.65 55.45,7.63 55.45,14.87 R27.2 | 63.63,4.49 64.78,4.49 66.53,2.73 66.53,2.49 R33.1
SIN_CORE  (via drill 0.4)
  Top 0.3: v82.28,5.86 81.14,5.86 81,5.72 R47.2 | v84.82,3.54 85.56,2.81 85.56,2.36 85.8,2.12 Z2.A | 59.1,18.02 58.2,18.92 58.2,20.12 C15.1 | IC3.7 59.98,17.15 59.1,18.02 | v53.45,13.2 52.5,12.24 52.5,11.42 R25.2 | v57.3,16.22 56.1,17.42 R27.1 | v58.8,17.72 59.1,18.02
  Top 0.305: v56.78,13.02 57.11,12.69 57.11,9.45 v57.13,9.42
  Bottom 0.3: v84.82,3.54 84.59,3.54 v82.28,5.86 | v53.45,13.2 54.27,13.2 55.4,14.32 v57.3,16.22 v58.8,17.72
  Bottom 0.305: v56.78,13.02 55.47,14.32 55.4,14.32 | v57.13,9.42 57.19,9.37 57.12,9.31 57.12,5.69 60.15,2.67 83.81,2.67 84.69,3.54 v84.82,3.54
SIN_FEEDBACK
  Top 0.3: IC3.10 62.74,9.47 63.6,8.8 64.85,7.55 R32.2 65.7,7.82 67.1,6.42 67.1,5.09 70.08,2.12 70.5,2.12 R36.2
SIN_INTEG_IN  (via drill 0.4)
  Top 0.3: 61.4,18.22 60,19.63 60,20.12 C15.2 | IC3.6 61.38,16.92 61.38,18.2 61.4,18.22 | v85.48,15.22 85.47,15.24 85.8,15.57 85.8,16.82 IC4.12 | 61.4,18.22 v61.8,18.62
  Bottom 0.3: v85.48,15.22 85.38,15.22 85,14.84 68.28,14.84 64.5,18.62 v61.8,18.62
SIN_OTA2_IN+
  Top 0.3: 83.4,18.02 83.4,17.12 IC4.14
  Top 0.305: 83.4,18.02 81.21,20.21 R46.1 R45.2
SIN_OTA2_NEGATIVE
  Top 0.3: R50.2 84.75,21.32 84.75,16.89 IC4.13
START_AMP_EMIT
  Top 0.3: 70.2,19.73 70.2,14.42 T8.2
  Top 0.305: 70.2,19.73 72.11,21.64 74.32,21.64 75.12,22.44 R38.1
START_AMP_GATE
  Top 0.3: 72.6,14.42 74.4,14.42 C21.1 | 72.6,14.42 72.3,14.42 T8.1 | 72.6,14.42 72.6,17.72 R39.2
START_FREQ_EMIT
  Top 0.3: 97.36,20.27 98.1,19.53 98.1,15.92 T9.2
  Top 0.305: 97.36,20.27 92.06,20.27 R53.2
START_FREQ_GATE
  Top 0.3: 93,15.62 96,15.62 T9.1 | 93,15.62 93,12.32 R56.1 | 93,15.62 C24.2
V+  (via drill 0.4)
  Top 0.3: 87.6,21.32 C23.2 | 64,16.85 IC3.4 | 22.8,23.12 R7.1 | 24.6,20.42 C5.2 24.6,20.12 | IC1.4 | 69.2,23.42 R35.1 | 42.9,20.42 C11.2 | 46.2,22.82 IC2.8 | 11.7,23.12 R3.1 | 36.6,23.12 R13.1 | 78,14.42 R43.2 | 93.9,23.42 R55.2
  Top 0.61: 87.6,21.32 v87.6,19.82 87.6,18.67 87.25,18.32 IC4.11 | 64,16.85 64,20.03 C17.2 63,20.89 62.05,21.84 v62.05,22.2 | 22.8,23.12 22.8,22.22 v23.1,21.92 24.6,20.42 | IC1.4 25.91,18.81 24.6,20.12 | R39.1 74.21,19.75 v74.23,19.76 75.68,19.76 R42.2 | 42.9,20.42 43.8,20.42 45.6,22.22 | 46.2,22.82 45.6,22.22 | v13.2,21.62 11.7,23.12 | v36.6,21.92 36.6,23.12 | R19.1 40.14,22.8 v40.14,22.07 | v78,15.87 78,14.42 | v92.4,23.42 93.9,23.42 | v45.3,22.52 45.6,22.22 | C24.1 93.86,17.71 v94.36,18.21 94.7,17.86 T9.3 | v57.25,23.09 56.97,23.37 R26.1 | v76.5,25.07 76.5,26.18 R41.1 | v70.48,23.16 69.46,23.16 69.2,23.42
  Top 1.27: C2.+ C4.1 F2.1
  Bottom 0.3: v78,15.87 78,15.84 | v45.3,22.52 45.3,22.86
  Bottom 0.305: 76.58,22.94 76.5,22.86 | 92.4,23.13 92.13,22.86 | 87.6,22.84 87.62,22.86
  Bottom 0.61: v13.2,21.62 13.58,21.32 | 36.6,22.86 v36.6,21.92 | 40.14,22.86 v40.14,22.07 | v78,15.87 77.94,15.87 76.5,17.32 76.5,22.86 | 78,15.84 83.68,15.84 87.6,19.76 v87.6,19.82 87.6,22.84 | 74.23,22.86 v74.23,19.76 | 23.1,22.86 v23.1,21.92 | 62.05,22.86 v62.05,22.2 | v57.25,23.09 57.25,22.88 57.23,22.86 | v76.5,25.07 76.58,25.07 76.58,22.94 | v70.48,23.16 70.48,22.86
  Bottom 0.813: 76.58,22.94 76.58,36.69 U_FREQ_POT.P$4 | v92.4,23.42 92.4,23.13
  Bottom 1.27: C2.+ arc-38 13.58,21.32 arc-52 16.76,22.86 23.1,22.86 36.6,22.86 40.14,22.86 45.3,22.86 57.23,22.86 62.05,22.86 70.48,22.86 74.23,22.86 76.5,22.86 87.62,22.86 92.13,22.86 94.37,20.62 94.37,18.23 v94.36,18.21
V-  (via drill 0.4)
  Top 0.3: 64.01,10.11 64.24,9.88 | 68.4,7.82 C19.1 | IC3.11 | 88.2,35.72 R51.1 | 85.73,39.99 U_FREQ_POT.P$6 | 24.89,6.16 C6.1 | 71.4,12.02 T8.3 | 74.4,12.02 C21.2
  Top 0.305: v64.15,9.97 v64.15,9.97 arc-90 64.24,9.88
  Top 0.559: 50.16,16.85 IC2.4
  Top 0.61: 68.4,7.82 67.91,7.82 66.7,9.03 65.09,9.03 64.24,9.88 | IC3.11 64.01,10.11 | 88.2,35.72 88.2,37.52 85.73,39.99 | 74.4,12.02 v72.9,12.02 71.4,12.02 | v95.79,11.92 95.73,11.92 94.03,10.21 92.97,10.21 | IC1.11 25.91,10.01 v25.94,9.97 v25.94,9.96 25.92,9.93 25.92,7.18 24.89,6.16 | v53.41,18.47 52.58,17.64 52.58,17.46 C14.1 52.48,16.85 50.16,16.85 | C22.1 87.21,7.9 v87.21,9.86 87.25,9.9 IC4.6
  Top 0.813: R56.2 92.97,10.21
  Top 1.27: F1.1 C3.2 C1.-
  Bottom 0.3: v72.9,12.02 72.9,11.68
  Bottom 0.305: 64.15,11.64 64.19,11.68
  Bottom 0.61: v87.21,9.86 87.21,11.68 | v64.15,9.97 64.15,11.64 | v25.94,9.97 25.96,9.99 25.96,11.68
  Bottom 0.813: v53.41,18.47 52.32,17.38 52.32,11.68 | v95.79,11.92 95.89,12.02 95.89,32.47 88.17,40.18 U_FREQ_POT.P$6
  Bottom 1.27: C1.- 5.59,17.78 arc90 7.62,15.75 17.27,15.75 arc-90 19.81,13.21 arc90 21.34,11.68 25.96,11.68 52.32,11.68 64.19,11.68 72.9,11.68 87.21,11.68 95.55,11.68 v95.79,11.92
ZENER_ANODE
  Top 0.3: 74.7,2.12 75.9,2.12 Z1.A | 74.7,2.12 72.6,2.12 R36.1 | 74.7,2.12 74.7,5.42 R40.2
ZENERS_CATHODES
  Top 0.3: Z1.C 79.5,2.12 82.5,2.12 Z2.C

### Text on the board
tNames: + | + | + | + | + | + | +
bNames: 270° | 225° | 180° | 135° | 90° | 45° | 0° | heptaphasis | -12V | v.1 kopimi 2019